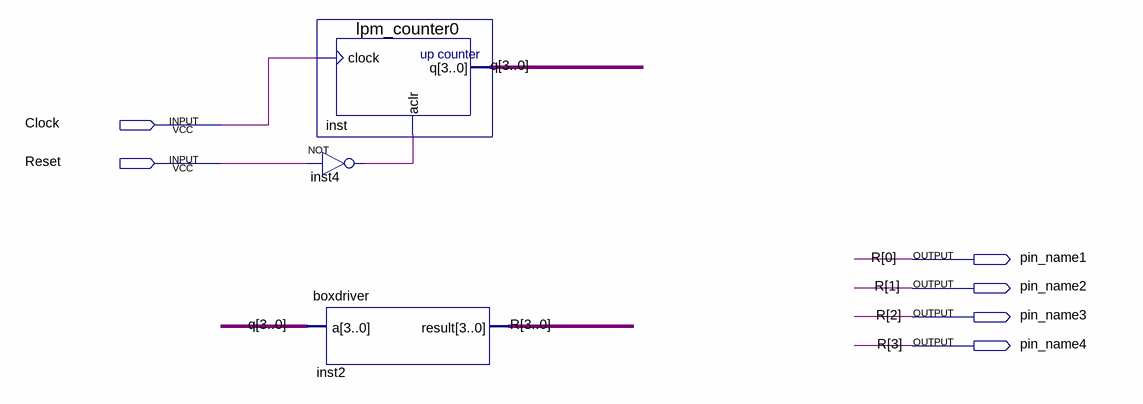
[diagram p0: schematic sheet]
// Quartus schematic flash.bdf as structural Verilog: 3 symbols, 6 pins
module flash (
  input  Clock,
  input  Reset,
  output pin_name1,
  output pin_name2,
  output pin_name3,
  output pin_name4
);

  wire inst4_out;
  wire [3:0] q;

  lpm_counter0 inst (.clock(Clock), .aclr(inst4_out), .q(q));
  not inst4 (inst4_out, Reset);
  boxdriver inst2 (.a(q), .result({pin_name4, pin_name3, pin_name2, pin_name1}));

  // Other names for the same wires on the sheet: R[3:0] = {pin_name4, pin_name3, pin_name2, pin_name1}
endmodule
